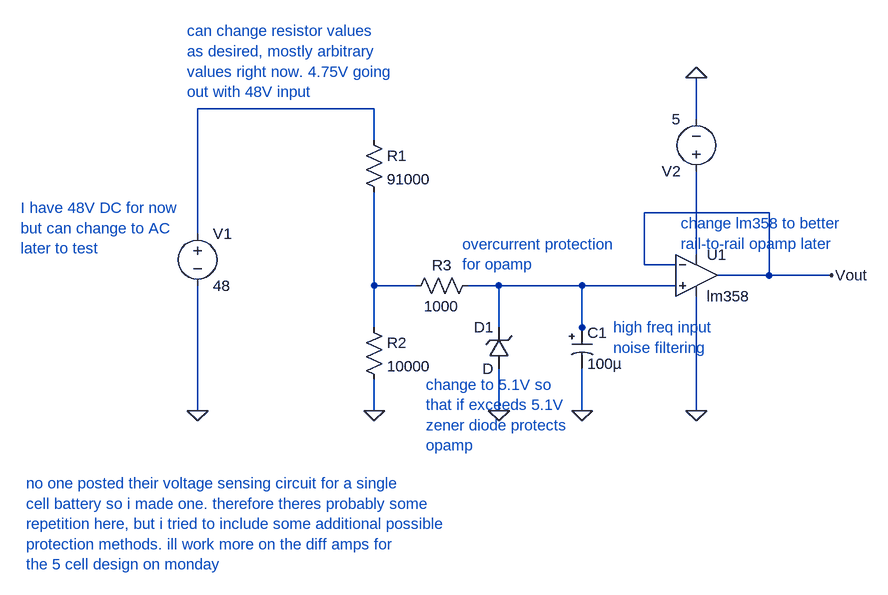
[diagram p0: schematic singlecell.asc]
singlecell.asc, the LTspice schematic file:
Version 4
SHEET 1 1128 680
WIRE 352 -288 80 -288
WIRE 848 -272 848 -336
WIRE 352 -240 352 -288
WIRE 960 -128 768 -128
WIRE 80 -96 80 -288
WIRE 848 -64 848 -192
WIRE 768 -48 768 -128
WIRE 816 -48 768 -48
WIRE 960 -32 960 -128
WIRE 960 -32 880 -32
WIRE 1056 -32 960 -32
WIRE 352 -16 352 -160
WIRE 416 -16 352 -16
WIRE 544 -16 496 -16
WIRE 672 -16 544 -16
WIRE 816 -16 672 -16
WIRE 352 48 352 -16
WIRE 544 48 544 -16
WIRE 672 48 672 -16
WIRE 672 64 672 48
WIRE 80 176 80 -16
WIRE 352 176 352 128
WIRE 544 176 544 112
WIRE 672 176 672 112
WIRE 848 176 848 0
FLAG 1056 -32 Vout
FLAG 544 176 0
FLAG 848 -336 0
FLAG 848 176 0
FLAG 672 176 0
FLAG 352 176 0
FLAG 80 176 0
SYMBOL voltage 80 -112 R0
WINDOW 123 0 0 Left 0
WINDOW 39 0 0 Left 0
SYMATTR InstName V1
SYMATTR Value 48
SYMBOL res 336 -256 R0
SYMATTR InstName R1
SYMATTR Value 91000
SYMATTR SpiceLine tol=0.1
SYMBOL res 336 32 R0
SYMATTR InstName R2
SYMATTR Value 10000
SYMATTR SpiceLine tol=0.1
SYMBOL lm358 848 -96 R0
SYMATTR InstName U1
SYMBOL zener 560 112 R180
WINDOW 0 24 64 Left 2
WINDOW 3 24 0 Left 2
SYMATTR InstName D1
SYMBOL res 512 -32 R90
WINDOW 0 0 56 VBottom 2
WINDOW 3 32 56 VTop 2
SYMATTR InstName R3
SYMATTR Value 1000
SYMBOL voltage 848 -176 R180
WINDOW 123 0 0 Left 0
WINDOW 39 0 0 Left 0
SYMATTR InstName V2
SYMATTR Value 5
SYMBOL polcap 656 48 R0
WINDOW 3 24 56 Left 2
SYMATTR InstName C1
SYMATTR Value 100µ
SYMATTR Description Capacitor
SYMATTR Type cap
SYMATTR SpiceLine V=2 Irms=4.10792 Rser=0.016 Lser=0 mfg="KEMET" pn="A700V107M002ATE016" type="Al electrolytic"
TEXT -192 -136 Left 2 ;I have 48V DC for now\nbut can change to AC \nlater to test
TEXT 824 -112 Left 2 ;change lm358 to better\nrail-to-rail opamp later
TEXT 432 136 Left 2 ;change to 5.1V so\nthat if exceeds 5.1V\nzener diode protects\nopamp
TEXT 488 -80 Left 2 ;overcurrent protection\nfor opamp
TEXT 720 48 Left 2 ;high freq input \nnoise filtering
TEXT 64 -408 Left 2 ;can change resistor values\nas desired, mostly arbitrary\nvalues right now. 4.75V going\nout with 48V input
TEXT -184 288 Left 2 ;no one posted their voltage sensing circuit for a single\ncell battery so i made one. therefore theres probably some\nrepetition here, but i tried to include some additional possible\nprotection methods. ill work more on the diff amps for\nthe 5 cell design on monday

The netlist it stands for:
* singlecell.asc
V1 N001 0 48
R1 N001 N003 91000 tol=0.1
R2 N003 0 10000 tol=0.1
* U1: lm358 (symbol lm358 not available, pins judged from their places): In+=N004 In-=Vout V+=N002 V-=0 OUT=Vout
D1 0 N004 D
R3 N004 N003 1000
V2 N002 0 5
C1 N004 0 100µ V=2 Irms=4.10792 Rser=0.016 Lser=0 mfg="KEMET" pn="A700V107M002ATE016" type="Al electrolytic"
.model D D
.lib standard.dio
* I have 48V DC for now
* but can change to AC
* later to test
* change lm358 to better
* rail-to-rail opamp later
* change to 5.1V so
* that if exceeds 5.1V
* zener diode protects
* opamp
* overcurrent protection
* for opamp
* high freq input
* noise filtering
* can change resistor values
* as desired, mostly arbitrary
* values right now. 4.75V going
* out with 48V input
* no one posted their voltage sensing circuit for a single
* cell battery so i made one. therefore theres probably some
* repetition here, but i tried to include some additional possible
* protection methods. ill work more on the diff amps for
* the 5 cell design on monday
.backanno
.end